# EAGLE schematic emonGLCD_V1.5 (EAGLE 6.4)
ABBREV: tx1; DRAWING_AUTHOR: Glyn Husdson; PROJECT: EmonTx V1.0
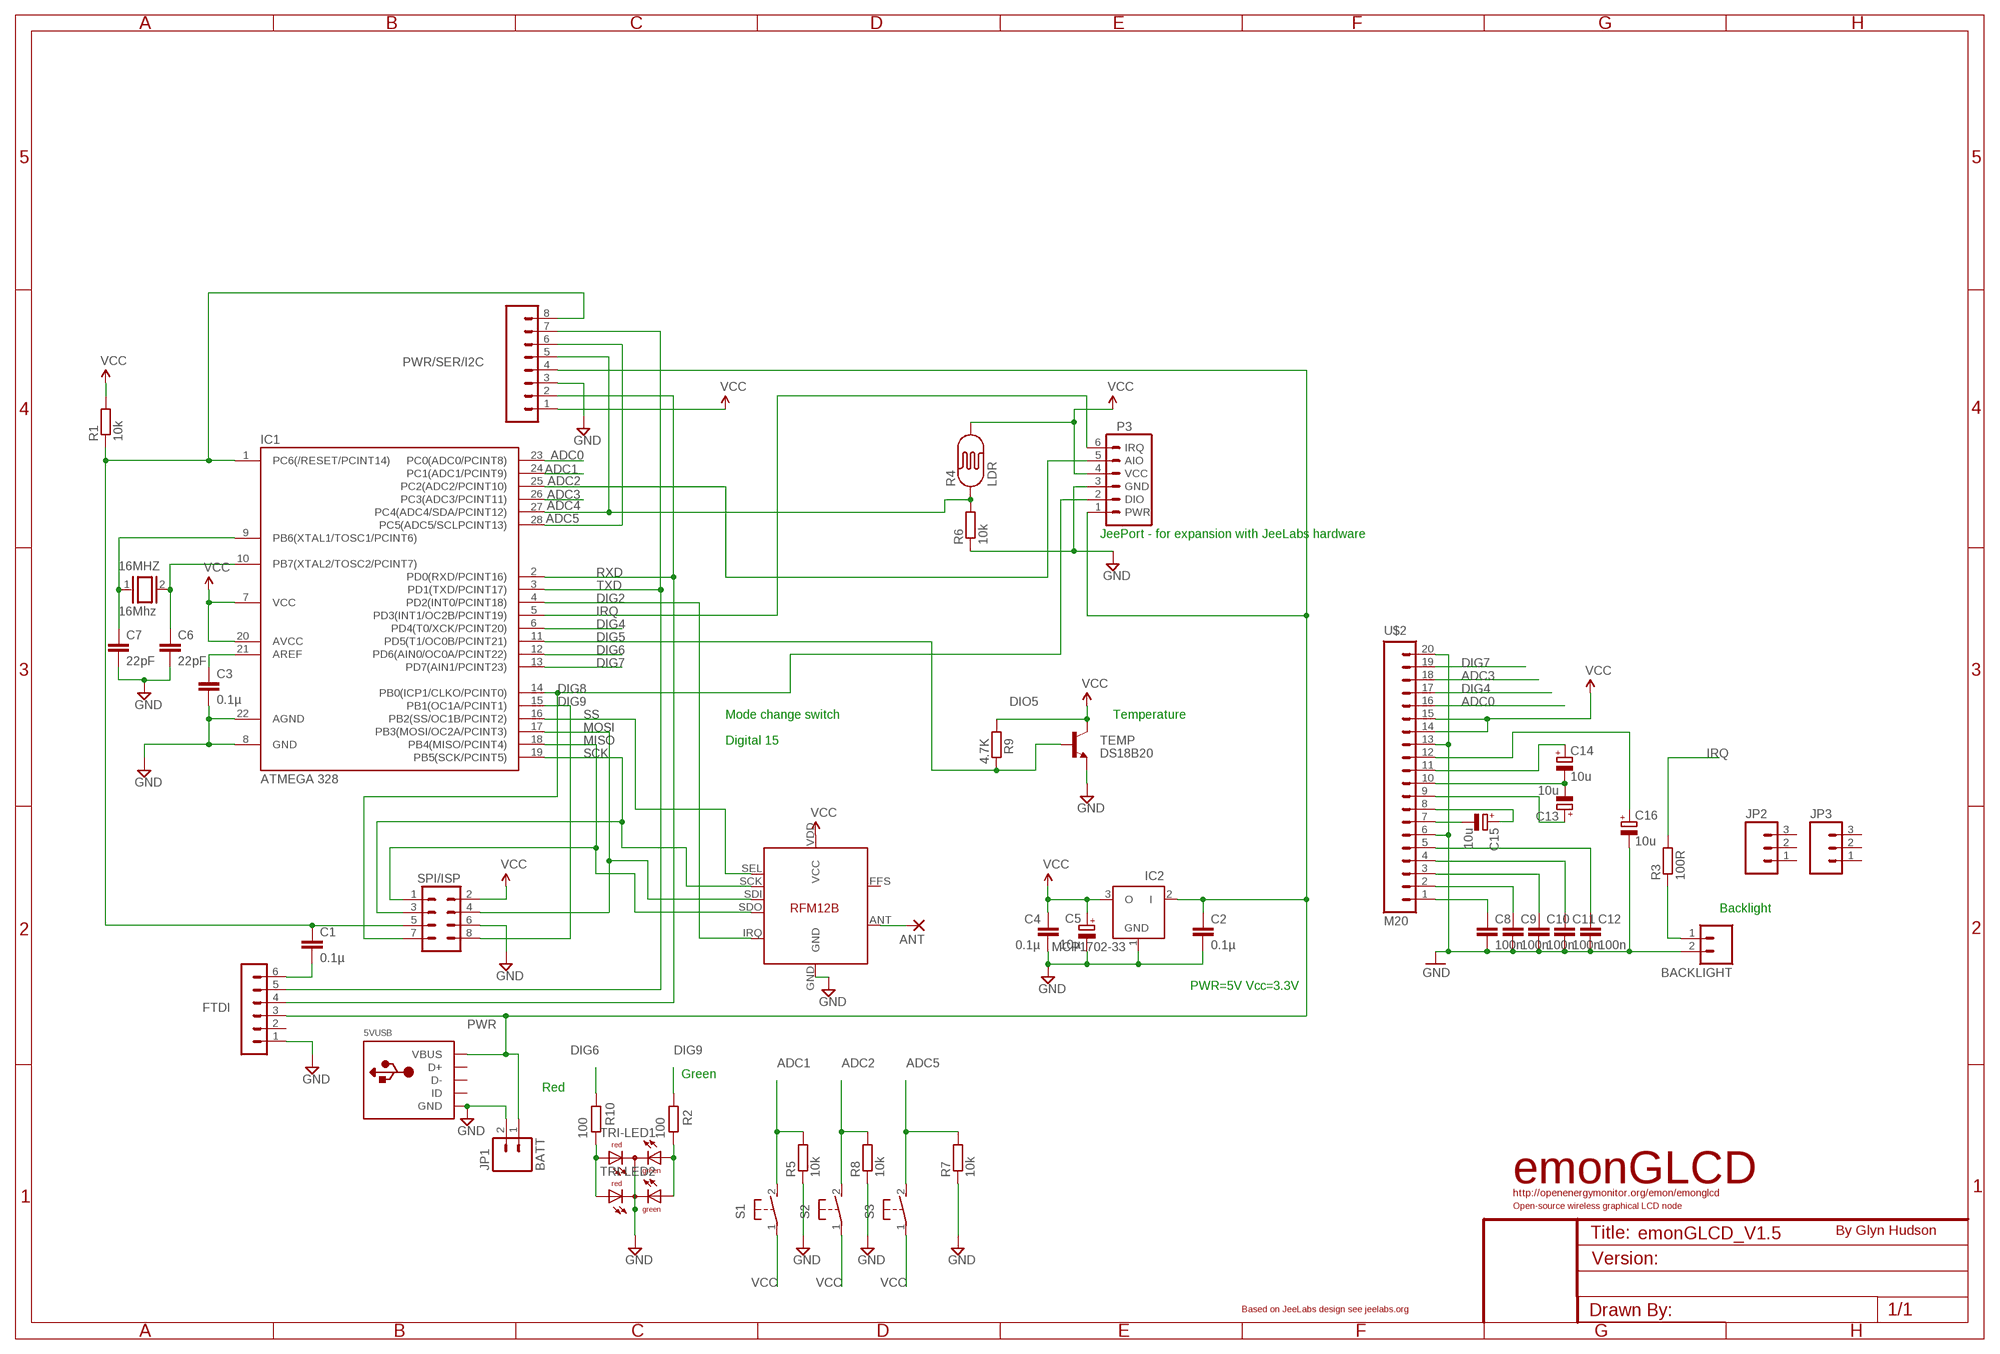
[diagram p0: schematic, sheet 1]

## Parts
5VUSB  USBMOLEX  [USB-MINIB-THM-MOLEX]
16MHZ  16Mhz  XTAL/S  [QS]
ANT  1,6/0,8  [1,6/0,8]
BACKLIGHT  M02PTH  [1X02]
C1  0.1µ  C-EU025-024X044  [C025-024X044]
C2  0.1µ  C-EU025-024X044  [C025-024X044]
C3  0.1µ  C-EU025-024X044  [C025-024X044]
C4  0.1µ  C-EU025-024X044  [C025-024X044]
C5  10µ  CPOL-EUE1.8-4  [E1,8-4]
C6  22pF  C2.5/2  [C2.5-2]
C7  22pF  C2.5/2  [C2.5-2]
C8  100n  C2.5/2  [C2.5-2]
C9  100n  C2.5/2  [C2.5-2]
C10  100n  C2.5/2  [C2.5-2]
C11  100n  C2.5/2  [C2.5-2]
C12  100n  C2.5/2  [C2.5-2]
C13  10u  CPOL-EUE1.8-4  [E1,8-4]
C14  10u  CPOL-EUE1.8-4  [E1,8-4]
C15  10u  CPOL-EUE1.8-4  [E1,8-4]
C16  10u  CPOL-EUE1.8-4  [E1,8-4]
FTDI  FTDI  MA06-1  [MA06-1]
IC1  ATMEGA 328  ATMEGA48/88/168-PU  [DIL28-3]
IC2  MCP1702-33  MCP1702Z  [TO92]
JP1  BATT  M02LOCK_LONGPADS  [1X02_LOCK_LONGPADS]
JP2  M03PTH  [1X03]
JP3  M03PTH  [1X03]
P3  JEEPORT  JEEPORT-LONGPADS  [PORT6PIN]
PWR/SER/I2C  M08  [1X08]
R1  10k  R-EU_0204/7  [0204/7]
R2  100  R-EU_0204/7  [0204/7]
R3  100R  R-EU_0204/7  [0204/7]
R4  LDR  PHOTOCELLPTH  [PHOTOCELL]
R5  10k  R-EU_0204/7  [0204/7]
R6  10k  R-EU_0204/7  [0204/7]
R7  10k  R-EU_0204/7  [0204/7]
R8  10k  R-EU_0204/7  [0204/7]
R9  4.7K  R-EU_0204/7  [0204/7]
R10  100  R-EU_0204/7  [0204/7]
S1  31-XX  [B3F-31XX]
S2  31-XX  [B3F-31XX]
S3  31-XX  [B3F-31XX]
SV7  SPI/ISP  MA04-2  [MA04-2]
TEMP  DS18B20  TRANSISTOR_NPNTO92  [TO-92]
TRI-LED1  DUOLED5MM  [DUOLED5MM]
TRI-LED2  DUOLED5MM  [DUOLED5MM]
U$1  RFM12B  [RFM12B]
U$2  M20  [1X20]

## Nets
ADC0: IC1.23(PC0(ADC0/PCINT8)) U$2.16
ADC1: IC1.24(PC1(ADC1/PCINT9)) R5.2 S1.2(S)
ADC2: IC1.25(PC2(ADC2/PCINT10)) P3.5(AIO) R8.2 S2.2(S)
ADC3: IC1.26(PC3(ADC3/PCINT11)) U$2.18
ADC4: IC1.27(PC4(ADC4/SDA/PCINT12)) PWR/SER/I2C.5 R4.1 R6.2
ADC5: IC1.28(PC5(ADC5/SCLPCINT13)) PWR/SER/I2C.6 R7.2 S3.2(S)
DIG2: IC1.4(PD2(INT0/PCINT18)) U$1.IRQ
DIG4 [power]: IC1.6(PD4(T0/XCK/PCINT20)) U$2.17
DIG5: IC1.11(PD5(T1/OC0B/PCINT21)) R9.2 TEMP.2(B)
DIG6: IC1.12(PD6(AIN0/OC0A/PCINT22)) R10.2
DIG7: IC1.13(PD7(AIN1/PCINT23)) U$2.19
DIG8: IC1.14(PB0(ICP1/CLKO/PCINT0)) P3.2(DIO) SV7.7
DIG9: IC1.15(PB1(OC1A/PCINT1)) R2.2 SV7.8
GND [power]: 5VUSB.GND BACKLIGHT.2 C2.2 C3.2 C4.2 C5.- C6.2 C7.2 C8.2 C9.2 C10.2 C11.2 C12.2 C16.- FTDI.1 IC1.8(GND) IC1.22(AGND) IC2.1(GND) JP1.2 P3.3(GND) PWR/SER/I2C.3 R5.1 R6.1 R7.1 R8.1 SV7.6 TEMP.1(E) TRI-LED1.K(C) TRI-LED2.K(C) U$1.GND U$2.6 U$2.13 U$2.20
IRQ: IC1.5(PD3(INT1/OC2B/PCINT19)) P3.6(IRQ) R3.2
MISO: IC1.18(PB4(MISO/PCINT4)) SV7.1 U$1.SDO
MOSI: IC1.17(PB3(MOSI/OC2A/PCINT3)) SV7.4 U$1.SDI
N$1: 16MHZ.2 C6.1 IC1.10(PB7(XTAL2/TOSC2/PCINT7))
N$2: C8.1 U$2.1
N$3: C9.1 U$2.2
N$4: C13.- C14.- U$2.10
N$5: C10.1 U$2.3
N$6: C11.1 U$2.4
N$7: C12.1 U$2.5
N$8: R10.1 TRI-LED1.AR TRI-LED2.AR
N$12: 16MHZ.1 C7.1 IC1.9(PB6(XTAL1/TOSC1/PCINT6))
N$13: ANT.1(P) U$1.ANT
N$14: R2.1 TRI-LED1.AG TRI-LED2.AG
N$15: C1.2 FTDI.6
N$17: BACKLIGHT.1 R3.1
N$19: C3.1 IC1.21(AREF)
N$20: C14.+ U$2.11
N$22: C13.+ U$2.9
N$23: C15.- U$2.7
N$27: C15.+ U$2.8
N$28: C16.+ U$2.12
PWR [power]: 5VUSB.VBUS C2.1 FTDI.3 IC2.2(I) JP1.1 P3.1(PWR) PWR/SER/I2C.4
RST: C1.1 IC1.1(PC6(/RESET/PCINT14)) PWR/SER/I2C.8 R1.1 SV7.5
RXD: FTDI.4 IC1.2(PD0(RXD/PCINT16)) PWR/SER/I2C.2
SCK: IC1.19(PB5(SCK/PCINT5)) SV7.3 U$1.SCK
SS: IC1.16(PB2(SS/OC1B/PCINT2)) U$1.SEL
TXD: FTDI.5 IC1.3(PD1(TXD/PCINT17)) PWR/SER/I2C.7
VCC [power]: C4.1 C5.+ IC1.7(VCC) IC1.20(AVCC) IC2.3(O) P3.4(VCC) PWR/SER/I2C.1 R1.2 R4.2 R9.1 S1.1(P) S2.1(P) S3.1(P) SV7.2 TEMP.3(C) U$1.VDD(VCC) U$2.14 U$2.15
Unconnected: 5VUSB.D+ 5VUSB.D- 5VUSB.ID FTDI.2 JP2.1 JP2.2 JP2.3 JP3.1 JP3.2 JP3.3 U$1.FFS

## Notes on the sheet
- JeePort - for expansion with JeeLabs hardware
- DIO5
- Mode change switch | Temperature
- Digital 15
- Backlight
- PWR=5V Vcc=3.3V
- Green
- Red
- emonGLCD
- http://openenergymonitor.org/emon/emonglcd
- Open-source wireless graphical LCD node
- By Glyn Hudson
- Based on JeeLabs design see jeelabs.org

## Library data of the parts
5VUSB = adafruit:USB: USB Connectors USBMINIB - Surface Mount Female Mini-B USB Connector 4UConnector: 06564 By microbuilder.eu Thru-hole RA Female Mini-B USB Connector 4UConnector: 18732 By ladyada.net
16MHZ = special:XTAL/S: CRYSTAL
ANT = JeeLabs:1,6/0,8: THROUGH-HOLE PAD
BACKLIGHT JP1 = SparkFun:M02: Header 2 Standard 2-pin 0.1" header. Use with straight break away headers (SKU : PRT-00116), right angle break away headers (PRT-00553), swiss pins (PRT-00743), machine pins (PRT-00117), and female headers (PRT-00115). Molex polarized connector foot print use with SKU : PRT-08233 with associated crimp pins and housings.
C1-C4 = resistor:C-EU: CAPACITOR, European symbol
C5 C13-C16 = resistor:CPOL-EU: POLARIZED CAPACITOR, European symbol
C6-C12 = capacitor-wima:C: CAPACITOR naming: grid - package width
FTDI = JeeLabs:MA06-1: PIN HEADER
IC1 = atmega8:ATMEGA48/88/168-PU
IC2 = JeeLabs:MCP1702: 200 mA, Low Power Low Dropout Voltage Regulator
JP2 JP3 = SparkFun:M03: Header 3 Standard 3-pin 0.1" header. Use with straight break away headers (SKU : PRT-00116), right angle break away headers (PRT-00553), swiss pins (PRT-00743), machine pins (PRT-00117), and female headers (PRT-00115). Molex polarized connector foot print use with SKU : PRT-08232 with associated crimp pins and housings.
P3 = JeeParts:JEEPORT: PIN HEADER
PWR/SER/I2C = SparkFun:M08: Header 8 Standard 8-pin 0.1" header. Use with straight break away headers (SKU : PRT-00116), right angle break away headers (PRT-00553), swiss pins (PRT-00743), machine pins (PRT-00117), and female headers (PRT-00115).
R1 R5-R8 = resistor:R-EU_: RESISTOR, European symbol
R2 R3 R9 R10 = rcl:R-EU_: RESISTOR, European symbol
R4 = SparkFun:PHOTOCELL: Photocell Also known as a CdS photoresistor. This is a low cost way to detect light levels. Resistance decreases with more incoming light. SparkFun SKU: SEN-09088
S1-S3 = switch-omron:31-XX: OMRON SWITCH
SV7 = JeeLabs:MA04-2: PIN HEADER
TEMP = SparkFun:TRANSISTOR_NPN: Transistor NPN BJT configuration in SOT23 package. MMBT2222 is the common NPN we use. Double check BCE configuration again layout.
TRI-LED1 TRI-LED2 = led:DUOLED5MM: DUO LED 2 colors, 5 mm, round
U$1 = JeeLabs:RFM12B
U$2 = SparkFun:M20: This is just like the LOCK variant in that the holes are staggared by 5 mil, but except for the last two holes. They are not altered from the "standard" footprint layout. This is used for a special purpose on the layout of our Graphic LCD Backpack. Make sure you want to use this device before selecting it for you project!

## Net classes
0 default: width 0.254 mm, drill 0.6 mm, clearance 0.254 mm
1 power: width 0.305 mm, drill 0.6 mm, clearance 0.254 mm